# Altium schematic sheet resistors.SchDoc
size A4; SheetNumber: 3; SheetTotal: 6
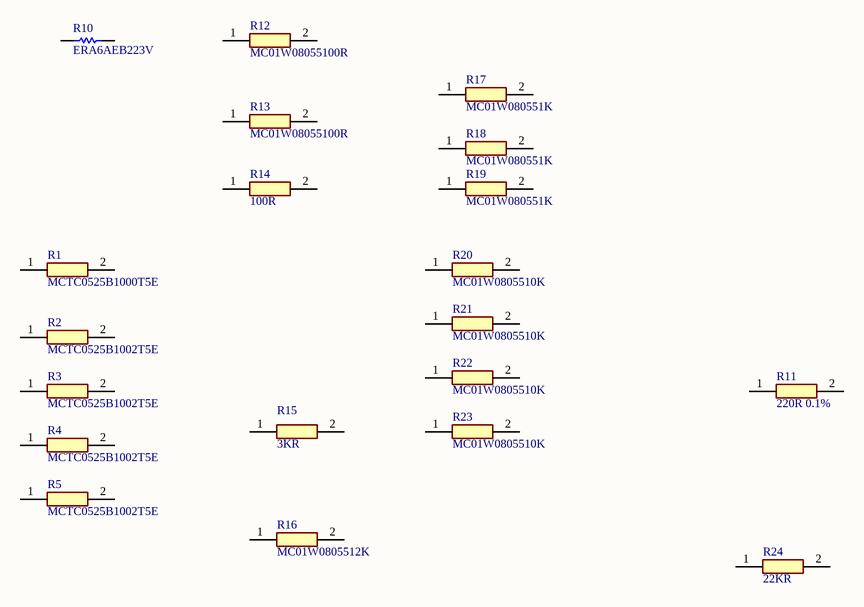
[diagram p0: resistors.SchDoc]

## Parts
R1  MCTC0525B1000T5E  [RESC2012X65N]
R2  MCTC0525B1002T5E  [RESC2012X65N]
R3  MCTC0525B1002T5E  [RESC2012X65N]
R4  MCTC0525B1002T5E  [RESC2012X65N]
R5  MCTC0525B1002T5E  [RESC2012X65N]
R10  ERA6AEB223V  [RESC2013X60X40ML20T25]
R11  220R 0.1%  [RESC2014X65N]
R12  MC01W08055100R  [RESC2014X65N]
R13  MC01W08055100R  [RESC2014X65N]
R14  100R  [RESC2014X65N]
R15  3KR  [RESC2014X65N]
R16  MC01W0805512K  [RESC2014X65N]
R17  MC01W080551K  [RESC2014X65N]
R18  MC01W080551K  [RESC2014X65N]
R19  MC01W080551K  [RESC2014X65N]
R20  MC01W0805510K  [RESC2014X65N]
R21  MC01W0805510K  [RESC2014X65N]
R22  MC01W0805510K  [RESC2014X65N]
R23  MC01W0805510K  [RESC2014X65N]
R24  22KR  [RESC2014X65N]

## Nets

Not connected (* = marked no-connect by the designer): R1 1 2; R2 1 2; R3 1 2; R4 1 2; R5 1 2; R10 1 2; R11 1 2; R12 1 2; R13 1 2; R14 1 2; R15 1 2; R16 1 2; R17 1 2; R18 1 2; R19 1 2; R20 1 2; R21 1 2; R22 1 2; R23 1 2; R24 1 2

## Library data of the parts
R1 = MCTC0525B1000T5E: Resistor; Manufacturer_Name: MULTICOMP; Datasheet Link: https://componentsearchengine.com/Datasheets/2/MCTC0525B1001T5E.pdf; Height: 0.65mm; Manufacturer_Part_Number: MCTC0525B1000T5E
R2-R5 = MCTC0525B1002T5E: Resistor; Manufacturer_Name: MULTICOMP; Datasheet Link: https://componentsearchengine.com/Datasheets/2/MCTC0525B1001T5E.pdf; Height: 0.65mm; Manufacturer_Part_Number: MCTC0525B1002T5E
R10 = CMP-2001-00614-1: Manufacturer: Panasonic; Part Number: ERA6AEB223V
R11-R15 R24 = MC01W08055100R: Resistor; Manufacturer_Name: MULTICOMP; Datasheet Link: http://www.farnell.com/datasheets/1729047.pdf; Height: 0.65mm; Manufacturer_Part_Number: MC01W08055100R
R16 = MC01W0805512K: Resistor; Manufacturer_Name: MULTICOMP; Datasheet Link: http://www.farnell.com/datasheets/1729047.pdf; Height: 0.65mm; Manufacturer_Part_Number: MC01W0805512K
R17-R19 = MC01W080551K: Resistor; Manufacturer_Name: MULTICOMP; Datasheet Link: http://www.farnell.com/datasheets/1729047.pdf; Height: 0.65mm; Manufacturer_Part_Number: MC01W080551K
R20-R23 = MC01W0805510K: Resistor; Manufacturer_Name: MULTICOMP; Datasheet Link: http://www.farnell.com/datasheets/1729047.pdf; Height: 0.65mm; Manufacturer_Part_Number: MC01W0805510K